# EAGLE design EthernetPlug (EAGLE 7.2.0)
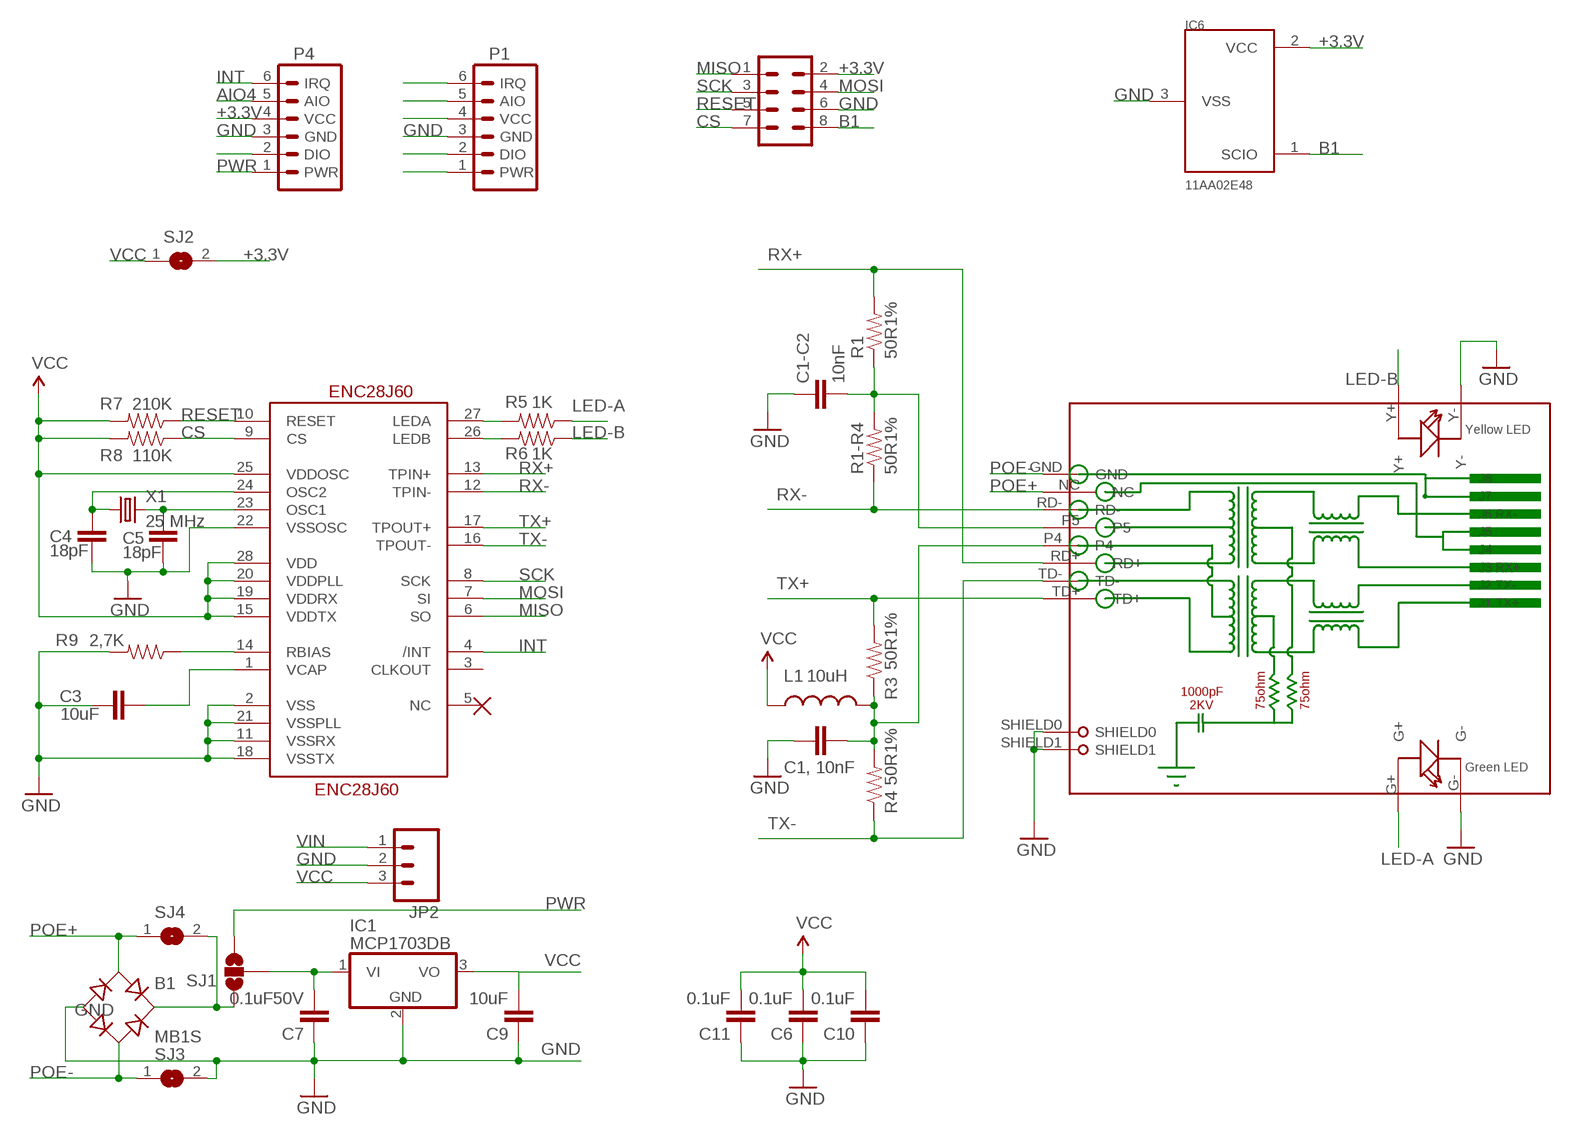
[diagram p0: schematic, sheet 1]

## Parts
B1  MB1S  [SOIC-4]
C1,  10nF  CAP0603-CAP  [0603-CAP]
C1-C2  10nF  CAP0603-CAP  [0603-CAP]
C3  10uF  CAP0603-CAP  [0603-CAP]
C4  18pF  CAP0603-CAP  [0603-CAP]
C5  18pF  CAP0603-CAP  [0603-CAP]
C6  0.1uF  CAP0603-CAP  [0603-CAP]
C7  0.1uF50V  CAP0603-CAP  [0603-CAP]
C9  10uF  CAP0603-CAP  [0603-CAP]
C10  0.1uF  CAP0603-CAP  [0603-CAP]
C11  0.1uF  CAP0603-CAP  [0603-CAP]
ENC28J60  ENC28J60  [SSOP28DB]
IC1  MCP1703DB  [SOT223]
IC6  11AA02E48  [SOT23]
ISP  MA04-2  [MA04-2]
JP2  M03PTH  [1X03]
L1  10uH  INDUCTOR0603  [0603]
P1  JEEPORT-FEMALE  [1X06_FEMALE_LOCK.010]
P4  JEEPORT-FEMALE  [1X06_FEMALE_LOCK.010]
R1  50R1%  RESISTOR0603-RES  [0603-RES]
R1-R4  50R1%  RESISTOR0603-RES  [0603-RES]
R3  50R1%  RESISTOR0603-RES  [0603-RES]
R4  50R1%  RESISTOR0603-RES  [0603-RES]
R5  1K  RESISTOR0603-RES  [0603-RES]
R6  1K  RESISTOR0603-RES  [0603-RES]
R7  210K  RESISTOR0603-RES  [0603-RES]
R8  110K  RESISTOR0603-RES  [0603-RES]
R9  2,7K  RESISTOR0603-RES  [0603-RES]
RJ1  HLJ-6115ANL  [HR911105A]
SJ1  SOLDERJUMPER_2WAYT  [SJ_2]
SJ2  SJ  [SJ]
SJ3  SJ  [SJ]
SJ4  SJ  [SJ]
X1  25 MHz  CRYSTAL3.2X2.5  [CRYSTAL-SMD-3.2X2.5]

## Nets
+3.3V [power]: IC6.2(VCC) ISP.2 P4.4(VCC) SJ2.2
AIO4: P4.5(AIO)
B1: IC6.1(SCIO) ISP.8
CS: ENC28J60.9(CS) ISP.7 R8.1
GND [power]: B1.- C1,.1 C1-C2.1 C3.1 C4.1 C5.1 C6.1 C7.1 C9.1 C10.1 C11.1 ENC28J60.2(VSS) ENC28J60.11(VSSRX) ENC28J60.18(VSSTX) ENC28J60.21(VSSPLL) ENC28J60.22(VSSOSC) IC1.2(GND) IC6.3(VSS) ISP.6 JP2.2 P1.3(GND) P4.3(GND) R9.2 RJ1.G- RJ1.SHIELD0 RJ1.SHIELD1 RJ1.Y- SJ3.2
INT: ENC28J60.4(/INT) P4.6(IRQ)
LED-A: R5.1 RJ1.G+
LED-B: R6.1 RJ1.Y+
MISO: ENC28J60.6(SO) ISP.1
MOSI: ENC28J60.7(SI) ISP.4
N$1: ENC28J60.14(RBIAS) R9.1
N$2: ENC28J60.27(LEDA) R5.2
N$3: ENC28J60.26(LEDB) R6.2
N$4: P1.6(IRQ)
N$6: P1.5(AIO)
N$7 [power]: B1.+ SJ1.1 SJ4.2
N$8: C4.2 ENC28J60.24(OSC2) X1.1
N$9: C5.2 ENC28J60.23(OSC1) X1.3
N$10: C3.2 ENC28J60.1(VCAP)
N$11: P1.4(VCC)
N$13: P4.2(DIO)
N$14: P1.2(DIO)
N$15: P1.1(PWR)
POE+ [power]: B1.~1(AC1) RJ1.NC SJ4.1
POE- [power]: B1.~2(AC2) RJ1.GND SJ3.1
PWR [power]: P4.1(PWR) SJ1.3
RCT: C1-C2.2 R1-R4.2 R1.1 RJ1.P5
RESET: ENC28J60.10(RESET) ISP.5 R7.1
RX+: ENC28J60.13(TPIN+) R1.2 RJ1.RD+
RX-: ENC28J60.12(TPIN-) R1-R4.1 RJ1.RD-
SCK: ENC28J60.8(SCK) ISP.3
TCT: C1,.2 L1.2 R3.1 R4.2 RJ1.P4
TX+: ENC28J60.17(TPOUT+) R3.2 RJ1.TD+
TX-: ENC28J60.16(TPOUT-) R4.1 RJ1.TD-
VCC [power]: C6.2 C9.2 C10.2 C11.2 ENC28J60.15(VDDTX) ENC28J60.19(VDDRX) ENC28J60.20(VDDPLL) ENC28J60.25(VDDOSC) ENC28J60.28(VDD) IC1.3(VO) JP2.3 L1.1 R7.2 R8.2 SJ2.1
VIN [power]: C7.2 IC1.1(VI) JP2.1 SJ1.2
Unconnected: ENC28J60.3(CLKOUT) ENC28J60.5(NC)

## Library data of the parts
B1 = rectifier:MB*S: Bridge Rectifier Source: http://www.fairchildsemi.com/ds/MB/MB6S.pdf
C1, C1-C2 C3-C7 C9-C11 = SparkFun:CAP: Capacitor Standard 0603 ceramic capacitor, and 0.1" leaded capacitor.
ENC28J60 = SparkFun:ENC28J60
IC1 = linear:MCP1703: 250 mA, 16V, Low Quiescent Current LDO Regulator Source: http://ww1.microchip.com/downloads/en/DeviceDoc/22049b.pdf
IC6 = nanode:11AA02E48
ISP = JeeLabs:MA04-2: PIN HEADER
JP2 = SparkFun:M03: Header 3 Standard 3-pin 0.1" header. Use with straight break away headers (SKU : PRT-00116), right angle break away headers (PRT-00553), swiss pins (PRT-00743), machine pins (PRT-00117), and female headers (PRT-00115). Molex polarized connector foot print use with SKU : PRT-08232 with associated crimp pins and housings.
L1 = SparkFun:INDUCTOR: Inductors Basic Inductor/Choke - 0603 and 1206. Footprints are not proven and vary greatly between part numbers.
P1 P4 = JeeLabs:JEEPORT: PIN HEADER
R1 R1-R4 R3-R9 = SparkFun:RESISTOR: Resistor Basic schematic elements and footprints for 0603, 1206, and PTH resistors.
RJ1 = Itead_BP_110825:HLJ-6115ANL: SOC015
SJ1 = SparkFun:SOLDERJUMPER_2WAY: Solder Jumper 2 way solder jumper
SJ2-SJ4 = jumper:SJ: SMD solder JUMPER
X1 = JeeLabs:CRYSTAL: Crystals Various standard crystals. Proven footprints. Spark Fun Electronics SKU : COM-00534

## Net classes
0 default: width 0.203 mm, clearance 0.152 mm
1 power: width 0.381 mm, clearance 0.254 mm

## Board
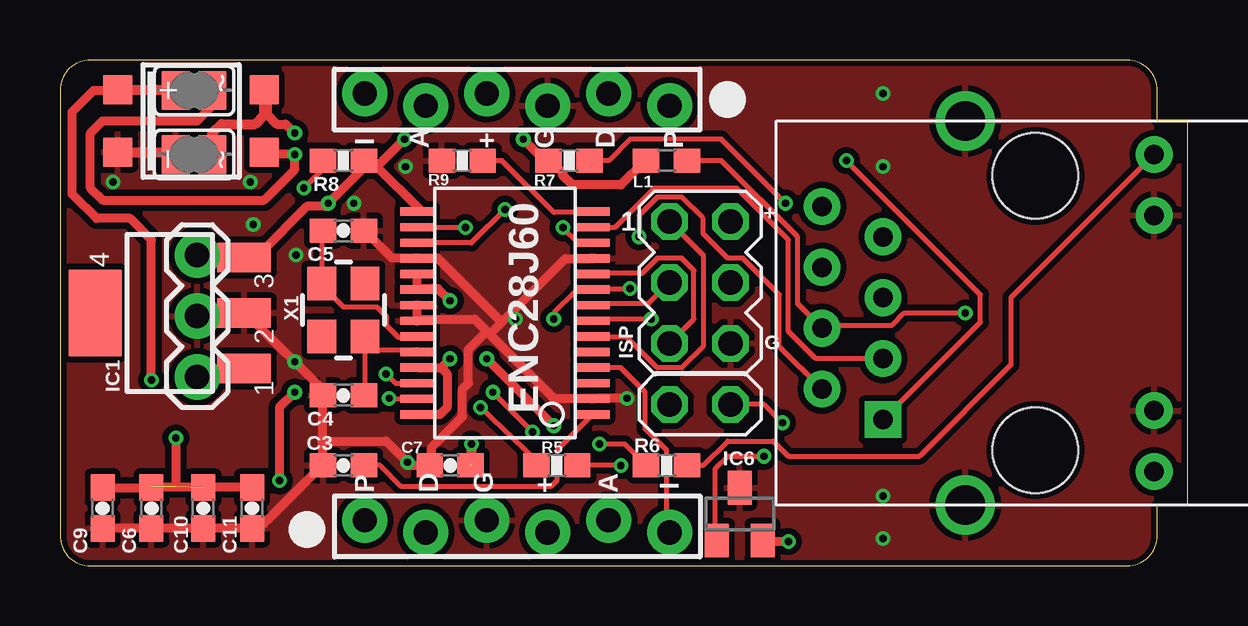
[diagram p1: board, top side]
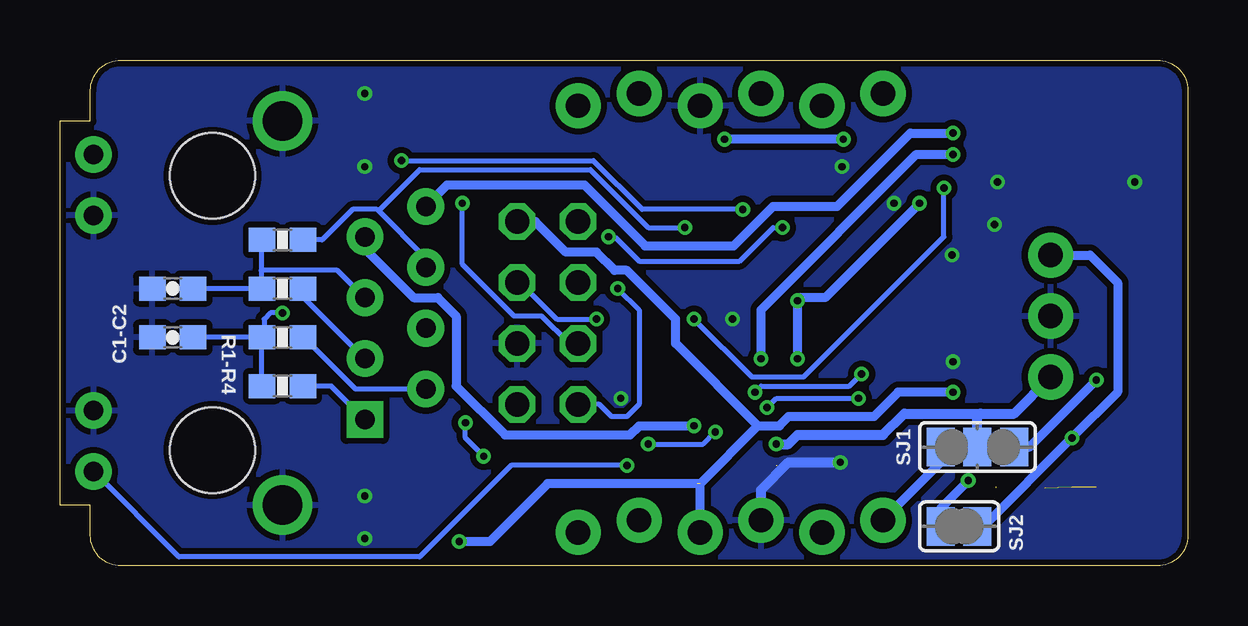
[diagram p2: board, bottom side, seen from below]

Size 46.99 x 21.08 mm. Coordinates in mm from the lower left corner, seen from the top.
Outline: 0,19.81 0,1.27 arc90 1.27,0 44.45,0 arc90 45.72,1.27 45.72,2.54 46.99,2.54 46.99,18.54 45.72,18.54 45.72,19.81 arc90 44.45,21.08 1.27,21.08 arc90 0,19.81
Copper layers (1*16): Top 0.035mm / dielectric 1.5mm / Bottom 0.035mm
Design rules "default": minimum track width 6mil, minimum drill 12mil, track to track 6mil, track to pad 6mil, pad to pad 6mil, via to via 6mil, smd to smd 0mil, copper to edge 10mil, drill to drill 10mil, minimum pad ring 10mil, minimum via ring 6mil, stop-mask expansion 2mil, vias tented up to drill 100mil, thermal gap 10mil

### Footprints (pad centres in the part's own frame; a part is rotated, then mirrored left to right if it is on the bottom)
SOIC-4 = smd 1.2 x 1.2: + 1.3,3.05; - -1.3,3.05; ~1 -1.3,-3.05; ~2 1.3,-3.05
0603-CAP = smd 1.1 x 1: 1 -0.85,0; 2 0.85,0
SSOP28DB = smd 0.348 x 1.397: 1 -4.225,-3.656; 2 -3.575,-3.656; 3 -2.925,-3.656; 4 -2.275,-3.656; 5 -1.625,-3.656; 6 -0.975,-3.656; 7 -0.325,-3.656; 8 0.325,-3.656; 9 0.975,-3.656; 10 1.625,-3.656; 11 2.275,-3.656; 12 2.925,-3.656; 13 3.575,-3.656; 14 4.225,-3.656; 15 4.225,3.656; 16 3.575,3.656; 17 2.925,3.656; 18 2.275,3.656; 19 1.625,3.656; 20 0.975,3.656; 21 0.325,3.656; 22 -0.325,3.656; 23 -0.975,3.656; 24 -1.625,3.656; 25 -2.275,3.656; 26 -2.925,3.656; 27 -3.575,3.656; 28 -4.225,3.656
SOT223 = smd 1.219 x 2.235: 1 -2.311,-3.099; 2 0,-3.099; 3 2.311,-3.099 | smd 3.6 x 2.2: 4 0,3.099
SOT23 = smd 1 x 1.4: 1 -0.95,-1.1; 2 0.95,-1.1; 3 0,1.1
MA04-2 = drill 1.016 octagon: 1 -3.81,-1.27; 2 -3.81,1.27; 3 -1.27,-1.27; 4 -1.27,1.27; 5 1.27,-1.27; 6 1.27,1.27; 7 3.81,-1.27; 8 3.81,1.27
1X03 = drill 1.016 pad 1.88: 1 0,0; 2 2.54,0; 3 5.08,0
0603 = smd 1.1 x 1: 1 -0.85,0; 2 0.85,0
1X06_FEMALE_LOCK.010 = drill 1.016 pad 1.88: 1 0,0.254; 2 2.54,-0.254; 3 5.08,0.254; 4 7.62,-0.254; 5 10.16,0.254; 6 12.7,-0.254
0603-RES = smd 1.1 x 1: 1 -0.85,0; 2 0.85,0
HR911105A = drill 0.813 pad 1.524: G+ 4.953,-6.604; G- 4.953,-4.064; GND -8.89,4.445; NC -6.35,3.175; P4 -8.89,-0.635; P5 -6.35,0.635; RD+ -6.35,-1.905; RD- -8.89,1.905; TD- -8.89,-3.175; Y+ 4.953,6.604; Y- 4.953,4.064 | drill 1.651 pad 2.159: SHIELD0 -2.921,8.001; SHIELD1 -2.921,-8.001 | drill 0.813 pad 1.524 square: TD+ -6.35,-4.445 | hole 3.556: 0,-5.715; 0,5.715
SJ_2 = smd 1.168 x 1.6: 1 -1.524,0; 2 0,0; 3 1.524,0
SJ = smd 1.168 x 1.6: 1 -0.762,0; 2 0.762,0
CRYSTAL-SMD-3.2X2.5 = smd 1.4 x 1.2: 1 -1.1,-0.9; 2 1.1,-0.9; 3 1.1,0.9; 4 -1.1,0.9

### Placement (x,y rotation side)
B1  5.46,18.54 90 top
C1,  42.29,9.53 0 bottom
C1-C2  42.29,11.56 0 bottom
C3  11.81,4.19 0 top
C4  11.81,7.11 0 top
C5  11.81,13.97 180 top
C6  3.81,2.41 90 top
C7  16.26,4.19 0 top
C9  1.78,2.41 90 top
C10  5.97,2.41 90 top
C11  8,2.41 90 top
ENC28J60  18.54,10.54 90 top
IC1  4.57,10.54 90 top
IC6  28.32,2.16 0 top
ISP  26.67,10.54 270 top
JP2  5.71,7.87 90 top
L1  25.27,16.89 0 top
P1  25.4,19.43 180 top
P4  12.7,1.65 0 top
R1  37.72,11.56 0 bottom
R1-R4  37.72,13.59 180 bottom
R3  37.72,7.49 0 bottom
R4  37.72,9.53 180 bottom
R5  20.7,4.19 180 top
R6  25.27,4.19 180 top
R7  21.21,16.89 180 top
R8  11.81,16.89 0 top
R9  16.76,16.89 180 top
RJ1  40.64,10.54 0 top
SJ1  8.76,4.95 180 bottom
SJ2  9.52,1.65 180 bottom
SJ3  5.59,17.14 180 top
SJ4  5.59,19.81 180 top
X1  11.81,10.67 90 top

### Tracks (layer width: path | path; a pad name or v marks a point on that pad's centre or on a via)
+3.3V  (via drill 0.3)  (1 unrouted)
  Top 0.381: v9.14,3.56 9.14,6.6 v9.78,7.24 | v30.35,1.02 29.34,1.02 IC6.2
  Bottom 0.381: SJ2.2 10.29,2.41 v9.14,3.56 | P4.4 20.32,3.43 17.91,5.84 | 17.91,5.84 17.02,5.84 16.64,6.22 13.08,6.22 12.06,7.24 v9.78,7.24 | ISP.2 27.18,14.35 25.91,13.08 24.64,13.08 23.88,12.32 23.37,12.32 21.34,10.29 21.34,9.27 17.91,5.84 | v30.35,1.02 29.08,1.02 26.67,3.43 20.45,3.43
B1  (via drill 0.3)
  Top 0.203: IC6.1 27.3,1.06 27.3,4.06 27.81,4.57 v29.34,4.57 | v30.1,5.97 29.34,6.73 ISP.8
  Bottom 0.203: v29.34,4.57 30.1,5.33 v30.1,5.97
CS  (via drill 0.3)
  Top 0.203: v10.16,15.75 10.92,16.51 10.92,16.89 R8.1 | v20.57,10.29 20.57,10.54 21.46,11.43 22.1,11.43 ENC28J60.9 22.22,11.56 v23.75,11.56
  Bottom 0.203: v10.16,15.75 10.16,13.72 16,7.87 18.16,7.87 v20.57,10.29 | ISP.7 24.51,6.73 24,6.22 23.37,6.22 22.86,6.73 22.86,10.67 v23.75,11.56
GND  (via drill 0.3)
  Top 0.381: C5.1 12.7,13.97 13.84,12.83 14.86,12.83 ENC28J60.18 14.99,12.83 15.75,12.83 18.41,10.16 | ENC28J60.21 14.86,10.79 14.86,10.29 ENC28J60.22 14.99,10.29 17.27,10.29 17.78,9.78 | 17.78,9.78 17.91,9.65 | 17.91,9.65 20.57,6.98 22.35,6.98 22.73,6.98 v23.62,6.98 | 22.1,12.8 21.06,12.8 18.41,10.16 | 17.91,9.65 18.41,10.16 | 10.92,5.21 10.92,7.11 C4.1 11.05,7.24 7.87,10.41 IC1.2 | 10.92,5.21 10.92,4.19 C3.1 10.79,4.06 8.51,1.78 8.13,1.78 | 10.92,5.21 13.59,5.21 v14.48,4.32 14.6,4.19 C7.1 15.49,4.32 15.49,4.95 16.76,6.22 16.76,7.37 17.02,7.62 17.02,9.02 17.78,9.78 | 16,16.89 R9.2 | C11.1 C10.1 C6.1 C9.1
  Top 0.406: B1.- 4.73,17.24 SJ3.2
  Bottom 0.381: 43.18,9.53 C1,.1 43.31,9.4 | 43.18,11.56 C1-C2.1 43.31,11.68
  Bottom 0.406: P4.3 17.78,3.17 16.64,4.32 v14.48,4.32
  other vias: 9.78,8.51 9.83,12.95 34.29,2.92 34.29,16.64 7.92,16 2.21,16 8.05,14.22 14.4,16.64 12.24,15.11 34.29,19.69 34.29,1.14 18.97,10.29
  pour Bottom: 0,19.81 0,1.27 arc90 1.27,0 44.45,0 arc90 45.72,1.27 45.72,2.54 46.99,2.54 46.99,18.54 45.72,18.54 45.72,19.81 arc90 44.45,21.08 1.27,21.08 arc90
  pour Top: 0,19.81 0,1.27 arc90 1.27,0 44.45,0 arc90 45.72,1.27 45.72,2.54 46.99,2.54 46.99,18.54 45.72,18.54 45.72,19.81 arc90 44.45,21.08 1.27,21.08 arc90
INT
  Top 0.203: P4.6 25.27,1.52 25.27,4.83 24.38,5.71 24.38,7.24 23.37,8.26 22.22,8.26 ENC28J60.4
LED-A  (via drill 0.3)
  Top 0.203: v23.37,4.19 R5.1
  Bottom 0.203: v23.37,4.19 28.19,4.19 32,0.38 42.04,0.38 RJ1.G+
LED-B
  Top 0.203: RJ1.Y+ 39.62,11.18 39.62,8.38 35.81,4.57 30.35,4.57 29.72,5.21 27.81,5.21 26.8,4.19 R6.1
MISO
  Top 0.203: ISP.1 26.8,12.95 26.8,9.14 25.91,8.26 24.89,8.26 23.62,9.53 22.22,9.53 ENC28J60.6
MOSI  (via drill 0.3)
  Top 0.203: v24.64,10.29 22.22,10.29 ENC28J60.7
  Bottom 0.203: v24.64,10.29 26.29,10.29 27.81,11.81 ISP.4
N$1
  Top 0.203: R9.1 18.41,16.89 20.57,14.73 22.22,14.73 ENC28J60.14
N$2  (via drill 0.3)
  Top 0.203: R5.2 19.81,4.19 19.81,4.44 v17.53,6.6 | 14.86,6.98 ENC28J60.27 13.73,6.97 v13.72,6.98
  Bottom 0.203: v17.53,6.6 17.14,6.98 v13.72,6.98
N$3  (via drill 0.3)
  Top 0.203: R6.2 23.53,5.08 v22.48,5.08 | v19.68,5.59 v18.03,7.24 | v13.59,8 13.97,7.62 ENC28J60.26
  Bottom 0.203: v22.48,5.08 20.19,5.08 v19.68,5.59 | v18.03,7.24 17.78,7.49 14.1,7.49 v13.59,8
N$7  (via drill 0.3)
  Top 0.381: v3.81,7.75 3.81,13.59 2.92,14.48 1.52,14.48 0.51,15.49 0.51,18.92 1.4,19.81 2.29,19.81 B1.+
  Top 0.406: SJ4.2 4.83,19.84 B1.+ 2.38,19.81
  Bottom 0.381: v3.81,7.75 6.6,4.95 SJ1.1
N$8
  Top 0.203: 12.7,9.02 12.7,9.53 X1.1 12.7,9.02 | 12.7,9.02 12.7,7.11 C4.2 | 12.7,9.02 14.86,9.02 ENC28J60.24
N$9
  Top 0.203: C5.2 10.92,13.97 10.92,11.81 X1.3 10.92,11.68 11.81,10.79 13.21,10.79 13.59,10.41 13.59,10.03 14.1,9.53 14.86,9.53 ENC28J60.23
N$10
  Top 0.203: C3.2 13.34,4.19 14.22,3.3 20.45,3.3 20.7,3.56 20.7,4.83 22.1,6.22 ENC28J60.1
POE+  (via drill 0.3)
  Top 0.381: v20.57,5.84 v17.78,8.64 | B1.~1 8.64,17.14 v9.78,17.14 9.78,16.51 8.51,15.24 1.78,15.24 1.27,15.75 1.27,18.03 1.78,18.54 5.71,18.54 6.35,19.18 SJ4.1
  Bottom 0.381: v9.78,17.14 11.3,17.14 17.78,10.67 v17.78,8.64 | v20.57,5.84 22.86,5.84 23.24,5.46 28.45,5.46 30.48,7.49 30.48,10.41 31.24,11.18 32.26,11.18 34.29,13.21 RJ1.NC
POE-  (via drill 0.3)
  Top 0.381: B1.~2 8.64,19.81 8.64,18.8 9.02,18.41 9.4,18.41 v9.78,18.03
  Top 0.406: SJ3.1 6.35,18.03 6.73,18.41 8.13,18.41 8.51,18.8 B1.~2
  Bottom 0.381: v9.78,18.03 11.56,18.03 14.6,14.99 17.27,14.99 18.92,13.34 22.61,13.34 25.15,15.88 30.86,15.88 RJ1.GND
PWR
  Bottom 0.381: SJ1.3 10.29,4.32 P4.1
RCT
  Bottom 0.203: 38.61,12.32 38.61,13.59 R1-R4.2 | 38.61,12.32 38.61,11.56 | 38.61,11.56 C1-C2.2 | 38.61,11.56 R1.1 | 38.61,12.32 35.43,12.32 RJ1.P5
RESET  (via drill 0.3)
  Top 0.203: R7.1 22.86,16.89 23.75,17.78 27.56,17.78 v30.23,15.11 | ISP.5 26.42,10.29 26.42,12.32 25.91,12.83 24.89,12.83 24.26,12.19 22.22,12.19 ENC28J60.10
  Bottom 0.203: v30.23,15.11 30.23,12.57 28.07,10.41 26.92,10.41 25.78,9.27 ISP.5
RX+
  Top 0.203: RJ1.RD+ 31.5,8.64 30.35,9.78 30.35,13.59 28.19,15.75 24.77,15.75 23.11,14.1 22.1,14.1 ENC28J60.13
  Bottom 0.203: RJ1.RD+ 36.83,11.18 36.83,11.56 R1.2
RX-  (via drill 0.3)
  Top 0.203: v20.95,14.1 21.59,13.46 22.22,13.46 ENC28J60.12
  Bottom 0.203: R1-R4.1 36.07,13.59 34.8,14.86 33.78,14.86 33.72,14.79 | 33.72,14.79 31.75,12.83 RJ1.RD- | v20.95,14.1 22.48,14.1 24.89,16.51 32,16.51 33.72,14.79
SCK
  Top 0.203: ISP.3 24.51,10.92 22.22,10.92 ENC28J60.8
TCT  (via drill 0.3)
  Top 0.203: L1.2 27.56,16.89 30.73,13.72 30.73,10.92 RJ1.P4 31.75,10.03 34.67,10.03 35.18,10.54 v37.72,10.54
  Bottom 0.203: 38.61,9.53 38.61,7.49 R3.1 | 38.61,9.53 C1,.2 | 38.61,9.53 R4.2 38.48,9.53 38.48,10.29 38.23,10.54 v37.72,10.54
TX+  (via drill 0.3)
  Top 0.203: v18.54,14.86 17.14,13.46 14.86,13.46 ENC28J60.17 | v32.77,16.89 38.35,11.3 38.35,10.16 RJ1.TD+
  Bottom 0.203: R3.2 35.69,7.49 RJ1.TD+ | v32.77,16.89 24.77,16.89 22.73,14.86 v18.54,14.86
TX-  (via drill 0.3)
  Top 0.203: v16.89,14.1 14.99,14.1 ENC28J60.16 | v24.13,13.72 24.13,14.61 24.89,15.37 25.91,15.37 26.8,14.48 26.8,13.84 27.81,12.83 28.45,12.83 29.97,11.3 29.97,9.14 RJ1.TD-
  Bottom 0.203: RJ1.TD- 34.67,7.37 36.83,9.53 R4.1 | v16.89,14.1 17.27,14.1 18.67,12.7 22.86,12.7 23.88,13.72 v24.13,13.72
VCC  (via drill 0.3)  (3 unrouted)
  Top 0.381: JP2.3 7.62,12.95 IC1.3 7.75,13.08 8.38,13.08 10.29,14.99 11.05,14.99 v11.18,15.11 12.83,16.76 R8.2 12.95,16.89 13.21,16.64 | v4.83,5.33 4.83,3.3 | ENC28J60.19 14.86,12.07 14.86,11.56 ENC28J60.20 14.99,11.56 15.75,11.56 v16.26,11.05 | 15.88,8.26 16.13,8 16.13,6.6 15.84,6.32 ENC28J60.28 | 15.88,8.26 14.99,8.26 ENC28J60.25 | 15.88,8.26 v16.26,8.64 | L1.1 24.38,16.89 23.37,15.88 21.34,15.88 20.95,16.26 20.95,16.38 20.45,16.89 R7.2 20.19,16.89 v19.3,17.78 | 13.21,16.64 14.99,14.86 ENC28J60.15 | 13.21,16.64 v14.35,17.78 | C9.2 C6.2 3.81,3.3 8,3.3
  Bottom 0.381: SJ2.1 8.51,1.65 v4.83,5.33 2.92,7.24 2.92,11.81 4.06,12.95 JP2.3 | v16.26,8.64 v16.26,11.05 16.13,11.18 15.11,11.18 v11.18,15.11 | v14.35,17.78 v19.3,17.78
VIN  (via drill 0.3)  (1 unrouted)
  Top 0.203: 7.62,8.13 IC1.1
  Top 0.381: 7.62,8.13 5.97,8.13 JP2.1
  Top 0.406: v17.14,5.08 17.14,4.19
  Bottom 0.406: v17.14,5.08 16.64,5.08 16.26,5.46 12.7,5.46 11.81,6.35 8.64,6.35 | 8.64,6.35 7.24,6.35 JP2.1 | SJ1.2 8.76,6.22 8.64,6.35

### Text on the board
_tsilk: P | I | A | + | G | D | 1 | + | G | P | D | G | + | A | I
_bsilk: Ethernet Plug v1 | TaaraLabs.eu/pe1 | TaaraLabs | PWR over Eth | PWR from Node | VCC to Node